# Altium project FlightBoard.PrjPcb
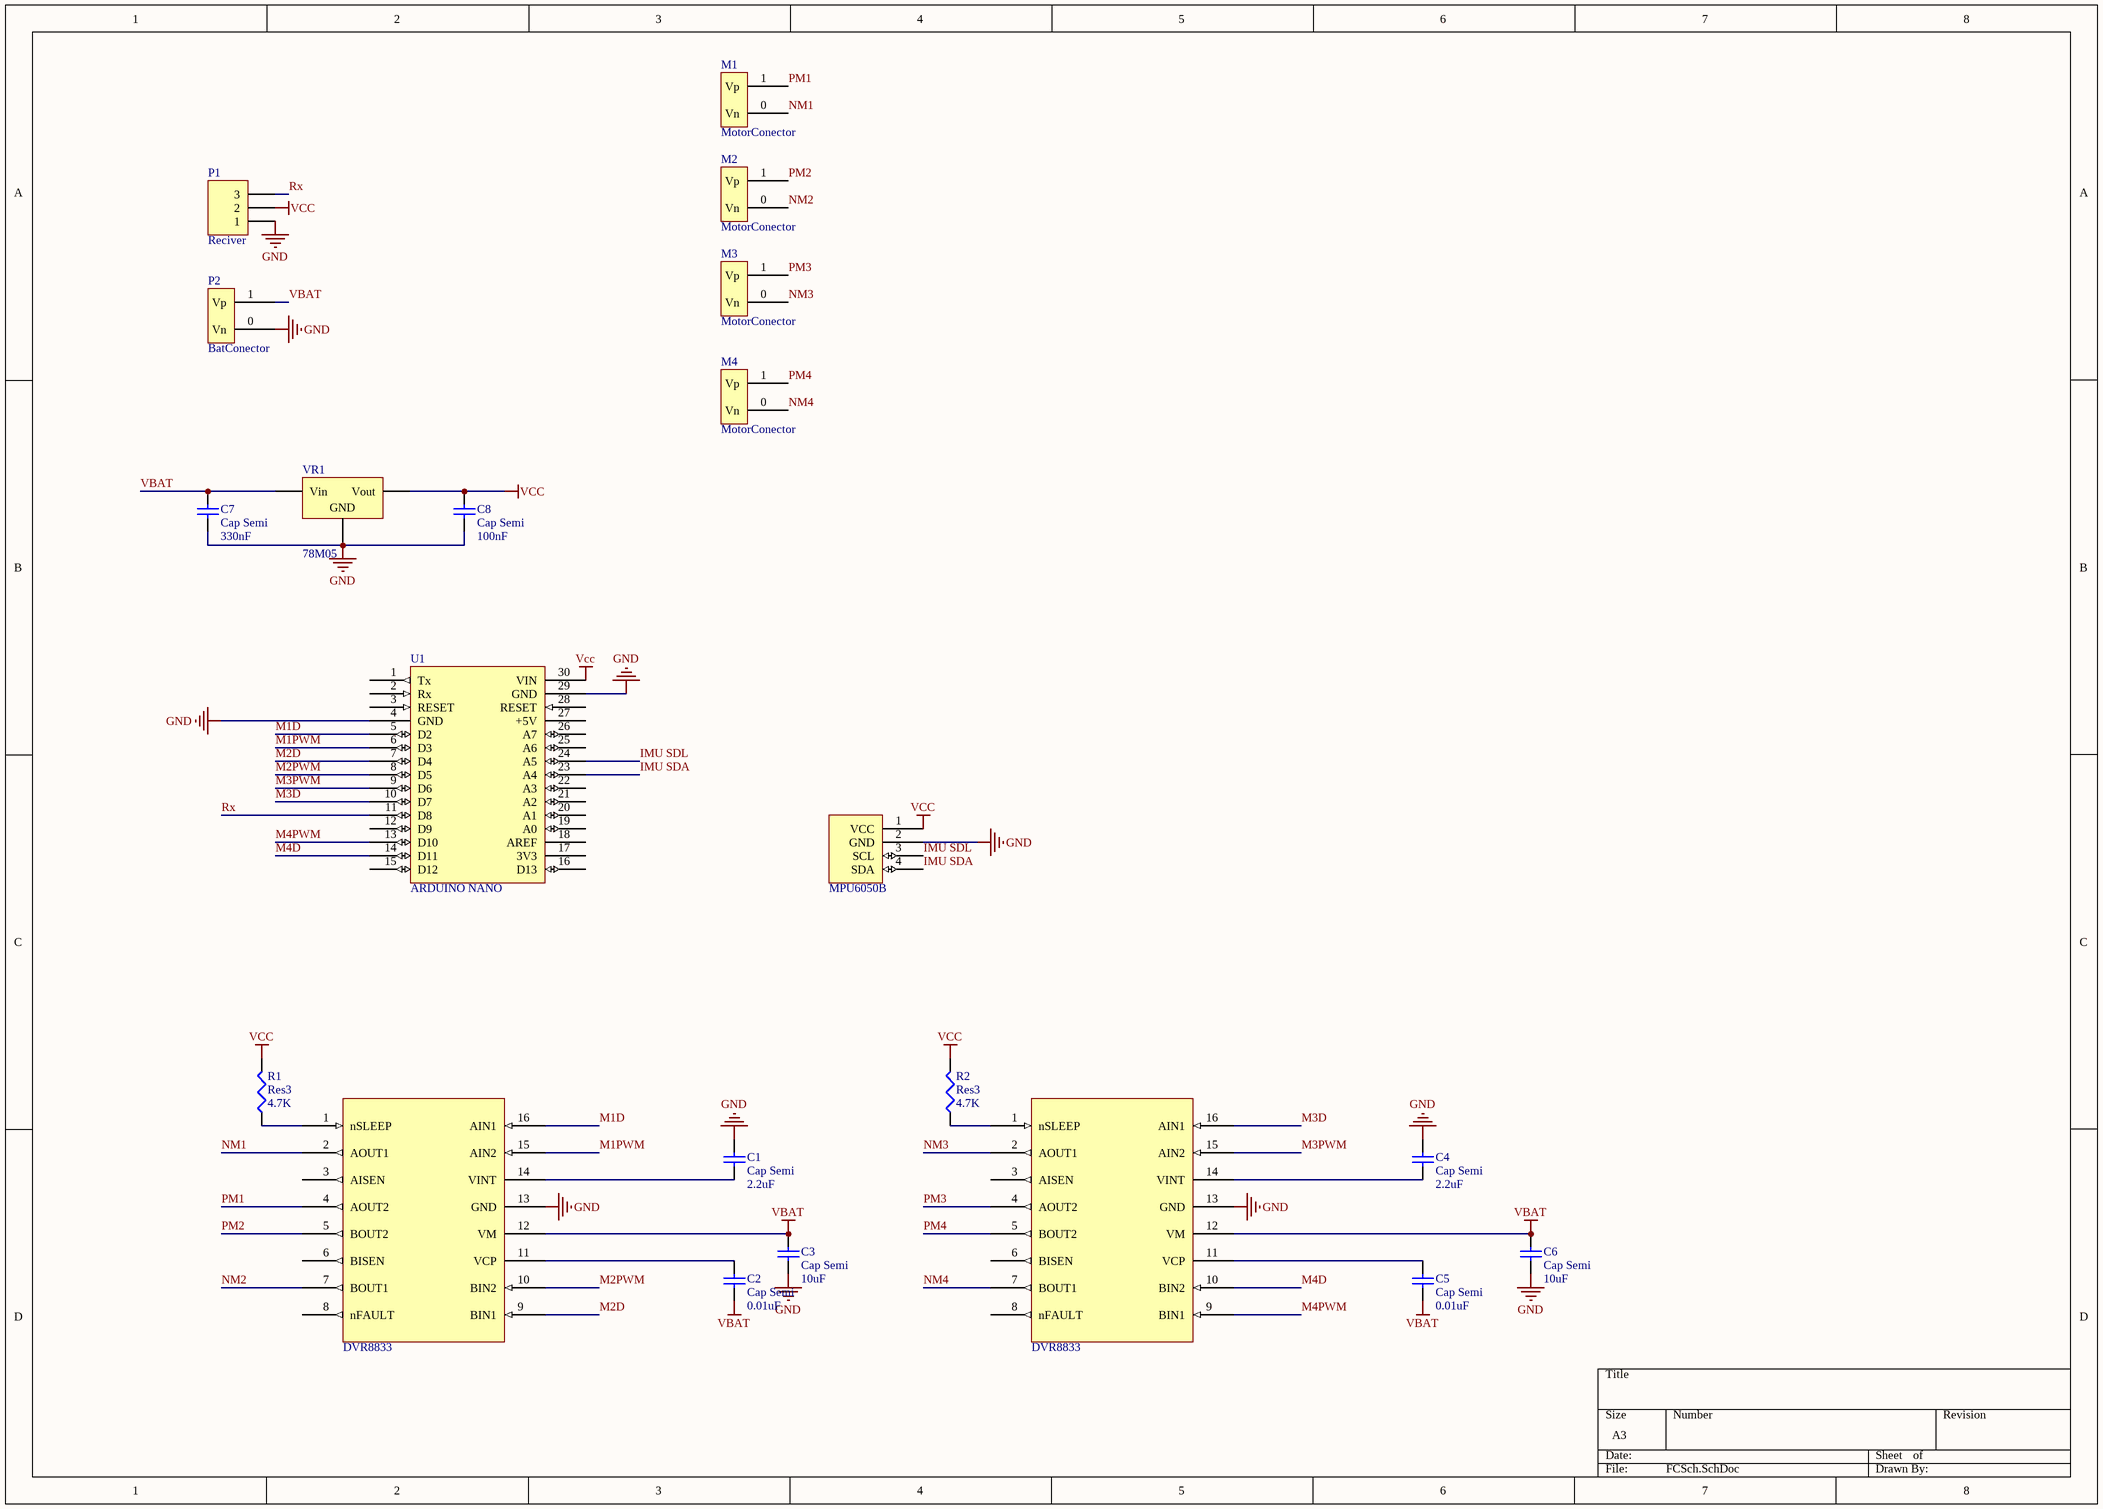
[diagram p0: FCSch.SchDoc]
1 sheet, 21 parts. Net scope: global (net labels, ports and power ports of the same name join across sheets).

## Sheet FCSch.SchDoc
size A3

### Parts
C1  Cap Semi  value 2.2uF  [1608[0603]]
C2  Cap Semi  value 0.01uF  [1608[0603]]
C3  Cap Semi  value 10uF  [C1206]
C4  Cap Semi  value 2.2uF  [1608[0603]]
C5  Cap Semi  value 0.01uF  [1608[0603]]
C6  Cap Semi  value 10uF  [C1206]
C7  Cap Semi  value 330nF  [1608[0603]]
C8  Cap Semi  value 100nF  [1608[0603]]
IC1  DVR8833  [DRV8833 TSOP]
IC2  DVR8833  [DRV8833 TSOP]
M1  MotorConector  [MotorConector]
M2  MotorConector  [MotorConector]
M3  MotorConector  [MotorConector]
M4  MotorConector  [MotorConector]
P1  Reciver  [HDR1X3]
P2  BatConector  [BatConector]
R1  Res3  value 4.7K  [6-0805_M]
R2  Res3  value 4.7K  [6-0805_M]
U1  ARDUINO NANO  [Arduino Nano]
U2  MPU6050B  [MPU6050B]
VR1  78M05  [D2PAK_M]

### Nets
GND: C1.2 C3.1 C4.2 C6.1 C7.1 C8.1 IC1.13(GND) IC2.13(GND) P1.1 P2.0(Vn) U1.4(GND) U1.29(GND) U2.2(GND) VR1.2(GND)
VBAT: C2.1 C3.2 C5.1 C6.2 C7.2 IC1.12(VM) IC2.12(VM) P2.1(Vp) VR1.1(Vin)
VCC: C8.2 P1.2 R1.2 R2.2 U1.30(VIN) U2.1(VCC) VR1.3(Vout)
IMU SDA: U1.23(A4) U2.4(SDA)
IMU SDL: U1.24(A5) U2.3(SCL)
M1D: IC1.16(AIN1) U1.5(D2)
M1PWM: IC1.15(AIN2) U1.6(D3)
M2D: IC1.9(BIN1) U1.7(D4)
M2PWM: IC1.10(BIN2) U1.8(D5)
M3D: IC2.16(AIN1) U1.10(D7)
M3PWM: IC2.15(AIN2) U1.9(D6)
M4D: IC2.10(BIN2) U1.14(D11)
M4PWM: IC2.9(BIN1) U1.13(D10)
NM1: IC1.2(AOUT1) M1.0(Vn)
NM2: IC1.7(BOUT1) M2.0(Vn)
NM3: IC2.2(AOUT1) M3.0(Vn)
NM4: IC2.7(BOUT1) M4.0(Vn)
PM1: IC1.4(AOUT2) M1.1(Vp)
PM2: IC1.5(BOUT2) M2.1(Vp)
PM3: IC2.4(AOUT2) M3.1(Vp)
PM4: IC2.5(BOUT2) M4.1(Vp)
Rx: P1.3 U1.11(D8)
NetC1_1: C1.1 IC1.14(VINT)
NetC2_2: C2.2 IC1.11(VCP)
NetC4_1: C4.1 IC2.14(VINT)
NetC5_2: C5.2 IC2.11(VCP)
NetIC1_1: IC1.1(nSLEEP) R1.1
NetIC2_1: IC2.1(nSLEEP) R2.1

Not connected (* = marked no-connect by the designer): IC1 3(AISEN) 6(BISEN) 8(nFAULT); IC2 3(AISEN) 6(BISEN) 8(nFAULT); U1 1(Tx) 2(Rx) 3(RESET) 12(D9) 15(D12) 16(D13) 17(3V3) 18(AREF) 19(A0) 20(A1) 21(A2) 22(A3) 25(A6) 26(A7) 27(+5V) 28(RESET)

### Library data of the parts
C1-C8 = Cap Semi: Capacitor (Semiconductor SIM Model); Published: 8-Jun-2000; LatestRevisionDate: 29-May-2009; LatestRevisionNote: IPC-7351 Footprint Added.; PackageReference: C1206; Publisher: Altium Limited; PackageDescription: Chip Capacitor
IC1 IC2 = DVR8833: DRV8833
P1 = Header 3: Header, 3-Pin; LatestRevisionDate: 17-Jul-2002; LatestRevisionNote: Re-released for DXP Platform.; Publisher: Altium Limited
R1 R2 = Res3: Resistor; Published: 8-Jun-2000; LatestRevisionDate: 29-May-2009; LatestRevisionNote: IPC-7351 Footprint Added.; PackageReference: J1-0603; Publisher: Altium Limited; PackageDescription: Chip Resistor
U2 = MPU6050B: MPU6050 Breakout
VR1 = Volt Reg: Voltage Regulator; Published: 24-Mar-1999; LatestRevisionDate: 29-May-2009; LatestRevisionNote: IPC-7351 Footprint Added.; PackageReference: D2PAK; Publisher: Altium Limited; PackageDescription: 3-Pin Transistor Outline Package 2.54 mm Pitch, 15.1 mm Lead Span